# Altium schematic sheet BMS.SchDoc
size A; DocumentNumber: 3; SheetNumber: 3; SheetTotal: 7
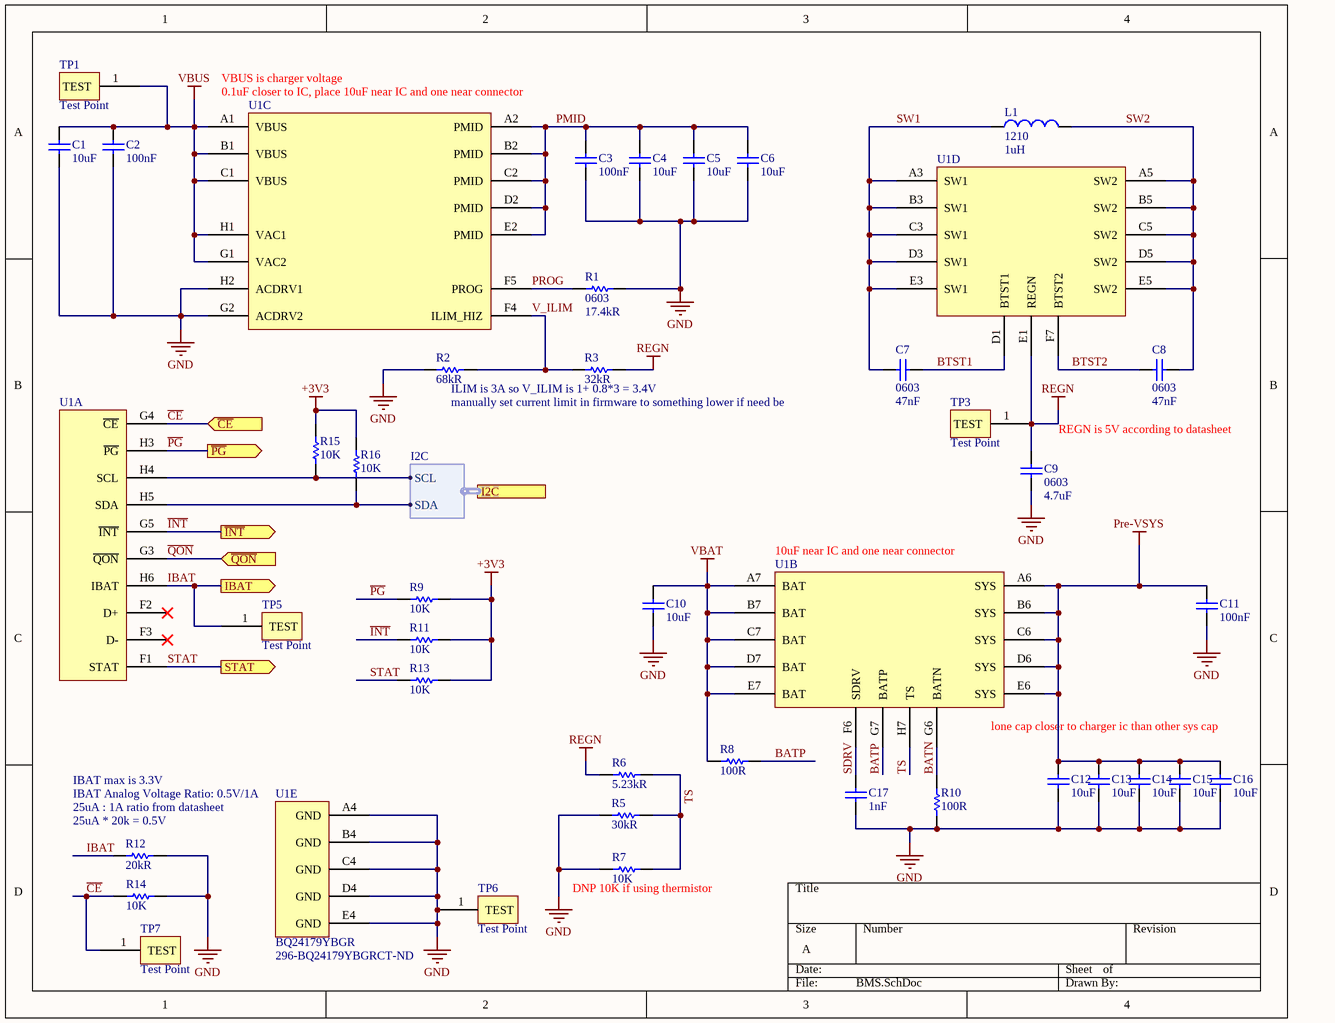
[diagram p0: BMS.SchDoc]

## Parts
C1  Capacitance: 10uF  [C0603]  (hidden comment: Capacitor 0603)
C2  Capacitance: 100nF  [C0402]  (hidden comment: Capacitor 0402)
C3  Capacitance: 100nF  [C0402]  (hidden comment: Capacitor 0402)
C4  Capacitance: 10uF  [C0603]  (hidden comment: Capacitor 0603)
C5  Capacitance: 10uF  [C0603]  (hidden comment: Capacitor 0603)
C6  Capacitance: 10uF  [C0603]  (hidden comment: Capacitor 0603)
C7  Package / Case: 0603  Capacitance: 47nF  [C0603]  (hidden comment: Capacitor 0603)
C8  Package / Case: 0603  Capacitance: 47nF  [C0603]  (hidden comment: Capacitor 0603)
C9  Package / Case: 0603  Capacitance: 4.7uF  [C0603]  (hidden comment: Capacitor 0603)
C10  Capacitance: 10uF  [C0603]  (hidden comment: Capacitor 0603)
C11  Capacitance: 100nF  [C0402]  (hidden comment: Capacitor 0402)
C12  Capacitance: 10uF  [C0603]  (hidden comment: Capacitor 0603)
C13  Capacitance: 10uF  [C0603]  (hidden comment: Capacitor 0603)
C14  Capacitance: 10uF  [C0603]  (hidden comment: Capacitor 0603)
C15  Capacitance: 10uF  [C0603]  (hidden comment: Capacitor 0603)
C16  Capacitance: 10uF  [C0603]  (hidden comment: Capacitor 0603)
C17  Capacitance: 1nF  [C0603]  (hidden comment: 478-1215-1-ND)
L1  Package / Case: 1210  Inductance: 1uH  [ind1210]  (hidden comment: Inductor 1210)
R1  Package / Case: 0603  Resistance: 17.4kR  [RES0603]  (hidden comment: Resistor 0603)
R2  Resistance: 68kR  [RES0402]  (hidden comment: Resistor 0402)
R3  Resistance: 32kR  [RES0402]  (hidden comment: Resistor 0402)
R5  Resistance: 30kR  [RES0402]  (hidden comment: Resistor 0402)
R6  Resistance: 5.23kR  [RES0402]  (hidden comment: Resistor 0402)
R7  Resistance (Ohms): 10K  [RES0603]  (hidden comment: ERJ-PB3B1002V)
R8  Resistance: 100R  [RES0603]  (hidden comment: Resistor 0603)
R9  Resistance (Ohms): 10K  [RES0603]  (hidden comment: ERJ-PB3B1002V)
R10  Resistance: 100R  [RES0603]  (hidden comment: Resistor 0603)
R11  Resistance (Ohms): 10K  [RES0603]  (hidden comment: ERJ-PB3B1002V)
R12  Resistance: 20kR  [RES0603]  (hidden comment: Resistor 0603)
R13  Resistance (Ohms): 10K  [RES0603]  (hidden comment: ERJ-PB3B1002V)
R14  Resistance (Ohms): 10K  [RES0603]  (hidden comment: ERJ-PB3B1002V)
R15  Resistance (Ohms): 10K  [RES0603]  (hidden comment: ERJ-PB3B1002V)
R16  Resistance (Ohms): 10K  [RES0603]  (hidden comment: ERJ-PB3B1002V)
TP1  Test Point  [TEST POINT]
TP3  Test Point  [TEST POINT]
TP5  Test Point  [TEST POINT]
TP6  Test Point  [TEST POINT]
TP7  Test Point  [TEST POINT]
U1  BQ24179YBGR  [BGA_79YBGR_TEX]  (value not drawn)  (parts A,B,C,D,E of 5)

## Ports
I2C (harness I2C), IBAT (out), STAT (out), ~{CE} (in), ~{INT} (out), ~{PG} (out), ~{QON} (in)

## Harnesses
I2C: SDA, SCL

## Nets
+3V3: R9.1 R11.1 R13.1 R15.1 R16.1
GND: C1.1 C2.1 C3.1 C4.1 C5.1 C6.1 C9.1 C10.1 C11.1 C12.1 C13.1 C14.1 C15.1 C16.1 C17.1 R1.1 R2.1 R5.1 R7.2 R10.1 R12.2 R14.1 TP6.1(TEST) U1.A4(GND) U1.B4(GND) U1.C4(GND) U1.D4(GND) U1.E4(GND) U1.G2(ACDRV2) U1.H2(ACDRV1)
Pre-VSYS: C11.2 C12.2 C13.2 C14.2 C15.2 C16.2 U1.A6(SYS) U1.B6(SYS) U1.C6(SYS) U1.D6(SYS) U1.E6(SYS)
REGN: C9.2 R3.2 R6.2 TP3.1(TEST) U1.E1(REGN)
VBAT: C10.2 R8.2 U1.A7(BAT) U1.B7(BAT) U1.C7(BAT) U1.D7(BAT) U1.E7(BAT)
VBUS: C1.2 C2.2 TP1.1(TEST) U1.A1(VBUS) U1.B1(VBUS) U1.C1(VBUS) U1.G1(VAC2) U1.H1(VAC1)
~{CE}: R14.2 TP7.1(TEST) U1.G4(~{CE}) ; port ~{CE}
~{INT}: R11.2 U1.G5(~{INT}) ; port ~{INT}
~{PG}: R9.2 U1.H3(~{PG}) ; port ~{PG}
~{QON}: U1.G3(~{QON}) ; port ~{QON}
BATN: R10.2 U1.G6(BATN)
BATP: R8.1 U1.G7(BATP)
BTST1: C7.2 U1.D1(BTST1)
BTST2: C8.1 U1.F7(BTST2)
IBAT: R12.1 TP5.1(TEST) U1.H6(IBAT) ; port IBAT
PMID: C3.2 C4.2 C5.2 C6.2 U1.A2(PMID) U1.B2(PMID) U1.C2(PMID) U1.D2(PMID) U1.E2(PMID)
PROG: R1.2 U1.F5(PROG)
SDRV: C17.2 U1.F6(SDRV)
STAT: R13.2 U1.F1(STAT) ; port STAT
SW1: C7.1 L1.1 U1.A3(SW1) U1.B3(SW1) U1.C3(SW1) U1.D3(SW1) U1.E3(SW1)
SW2: C8.2 L1.2 U1.A5(SW2) U1.B5(SW2) U1.C5(SW2) U1.D5(SW2) U1.E5(SW2)
TS: R5.2 R6.1 R7.1 U1.H7(TS)
V_ILIM: R2.2 R3.1 U1.F4(ILIM_HIZ)
NetR15_2: R15.2 U1.H4(SCL) ; port I2C.SCL
NetR16_2: R16.2 U1.H5(SDA) ; port I2C.SDA

Not connected (* = marked no-connect by the designer): U1 F2(D+)* F3(D-)*

## Notes on the sheet
- (near U1) VBUS is charger voltage
- (near U1) 0.1uF closer to IC, place 10uF near IC and one near connector
- ILIM is 3A so V_ILIM is 1+ 0.8*3 = 3.4V
- manually set current limit in firmware to something lower if need be
- REGN is 5V according to datasheet
- (near U1) 10uF near IC and one near connector
- (near U1) lone cap closer to charger ic than other sys cap
- IBAT Analog Voltage Ratio: 0.5V/1A
- (near R12) 25uA : 1A ratio from datasheet
- (near R12) 25uA * 20k = 0.5V
- IBAT max is 3.3V
- (near R7) DNP 10K if using thermistor

## Library data of the parts
C1 C4-C6 C10 C12-C16 = Capacitor 0603: Multilayer Ceramic Capacitors (High dielectric type), 25V, 10 uF, ± 20 %, 0603, X5R, RoHS; Manufacturer: Taiyo Yuden; Manufacturer Part Number: TMK107BBJ106MA-T; Tolerance: 20%; Package / Case: 0603; Supplier 1: Digi-Key; Supplier Part Number 1: 587-6023-1-ND; RoHS: Yes; Category: Ceramic Capacitors; Stock 1: 152813; Pricing 1: 1=0.46000, 10=0.32000, 50=0.22380, 100=0.19180, 500=0.14386, 1000=0.12149 (USD); Mount: Surface Mount; Case/Package: 0603; Case Code (Imperial): 0603; Case Code (Metric): 1608; Min Operating Temperature: -55°C; Max Operating Temperature: 85°C; Packaging: Tape and Reel; Voltage Rating: 25V; Lead Free: Lead Free; RoHS Compliant: Yes; ComponentLink1URL: http://ds.yuden.co.jp/TYCOMPAS/ut/detail.do?productNo=TMK107BBJ106MA-T&fileName=TMK107BBJ106MA-T_SS&mode=specSheetDownload&src-supplier=Digi-Key; ComponentLink1Description: http://ds.yuden.co.jp/TYCOMPAS/ut/detail.do?productNo=TMK107BBJ106MA-T&fileName=TMK107BBJ106MA-T_SS&mode=specSheetDownload&src-supplier=Digi-Key
C2 C3 C11 = Capacitor 0402: CAP CER 0.1UF 25V X5R 0402 / High Value Multilayer Ceramic Capacitors (High dielectric type); Manufacturer: Taiyo Yuden; Manufacturer Part Number: TMK105BJ104KV-F; Tolerance: 10%; Package / Case: 0402; Supplier 1: Digi-Key; Supplier Part Number 1: 587-1456-1-ND; RoHS: Yes; Category: Ceramic Capacitors; Stock 1: 2308231; Pricing 1: 1=0.10000, 10=0.04200, 50=0.02280, 100=0.01860, 500=0.01328, 1000=0.01044, 2500=0.00949, 5000=0.00873 (USD); Mount: Surface Mount; Case/Package: 0402; Number of Pins: 2; Case Code (Imperial): 0402; Case Code (Metric): 1005; Weight: 2.3E-05oz; Min Operating Temperature: -55°C; Max Operating Temperature: 85°C; Packaging: Tape and Reel; Dielectric: X5R; Voltage Rating (DC): 25V; Voltage Rating: 25V; Package Quantity: 1; Termination: SMD/SMT; Resistor Type: Ceramic; Voltage: 25V; Series: M; Construction: Flat; Length: 1mm; Width: 0.5mm; Height: 0.5mm; Depth: 0.5mm; Thickness: 0.022inch; REACH SVHC: No SVHC; Lead Free: Lead Free; Halogen Free: Halogen Free; RoHS Compliant: Yes; ComponentLink1URL: https://datasheet.ciiva.com/131/tmk105bj104kv-f-ss-131420.pdf?src-supplier=Digi-Key; ComponentLink1Description: https://datasheet.ciiva.com/131/tmk105bj104kv-f-ss-131420.pdf?src-supplier=Digi-Key; ComponentLink2URL: https://datasheet.ciiva.com/15922/28tmk105bj104kv-f-15922315.pdf?src-supplier=Onlinecomponents.com; ComponentLink2Description: https://datasheet.ciiva.com/15922/28tmk105bj104kv-f-15922315.pdf?src-supplier=Onlinecomponents.com; ComponentLink3URL: https://datasheet.ciiva.com/30051/25tmk105bj104kv-f-30051094.pdf?src-supplier=Onlinecomponents.com; ComponentLink3Description: https://datasheet.ciiva.com/30051/25tmk105bj104kv-f-30051094.pdf?src-supplier=Onlinecomponents.com; ComponentLink4URL: https://datasheet.ciiva.com/22768/1693457-22768649.pdf?src-supplier=Farnell; ComponentLink4Description: https://datasheet.ciiva.com/22768/1693457-22768649.pdf?src-supplier=Farnell
C7 C8 = Capacitor 0603: Cap Ceramic 0.047uF 50V X7R 10% SMD 0603 125°C Paper T/R; Manufacturer: KEMET; Manufacturer Part Number: C0603C473K5RAC7411; Supplier 1: Digi-Key; Supplier Part Number 1: 399-C0603C473K5RAC7411CT-ND; RoHS: Yes; Category: Ceramic Capacitors; Stock 1: 53312; Pricing 1: 1=0.10000, 10=0.07100, 50=0.03860, 100=0.03160, 500=0.02254, 1000=0.01771, 2500=0.01610, 5000=0.01481 (USD); Mount: Surface Mount; Case/Package: 0603; Dielectric Material: Ceramic; Min Operating Temperature: -55°C; Max Operating Temperature: 125°C; Tolerance: 10%; Dielectric: X7R; Voltage Rating (DC): 50V; Construction: Flat; Length: 1.6mm; Height: 0.8mm; Depth: 0.8mm; Radiation Hardening: No; RoHS Compliant: Yes; ComponentLink1URL: http://capacitoredge.kemet.com/capedge2/DataSheet?pn=C0603C473K5RAC7411&src-supplier=Avnet; ComponentLink1Description: http://capacitoredge.kemet.com/capedge2/DataSheet?pn=C0603C473K5RAC7411&src-supplier=Avnet; ComponentLink2URL: http://capacitoredge.kemet.com/capedge2/DataSheet?pn=C0603C473K5RAC7411&src-supplier=Avnet+Europe; ComponentLink2Description: http://capacitoredge.kemet.com/capedge2/DataSheet?pn=C0603C473K5RAC7411&src-supplier=Avnet+Europe
C9 = Capacitor 0603: CAP CER 4.7UF 25V X5R 0603; Manufacturer: TDK; Manufacturer Part Number: C1608X5R1E475M080AC; Dielectric Material: Ceramic; Tolerance: 20%; Supplier 1: Digi-Key; Supplier Part Number 1: 445-9040-1-ND; RoHS: Yes; Category: Ceramic Capacitors; Stock 1: 163174; Pricing 1: 1=0.38000, 10=0.25800, 50=0.17200, 100=0.14620, 500=0.10322, 1000=0.09032 (USD); Mount: Surface Mount; Case/Package: 0603; Case Code (Metric): 1608; Case Code (Imperial): 0603; Weight: 7.1E-05oz; Min Operating Temperature: -55°C; Max Operating Temperature: 85°C; Voltage Rating (DC): 25V; Packaging: Tape and Reel; Voltage Rating: 25V; Termination: SMD/SMT; Series: C; Package Quantity: 1; Dielectric: X5R; Resistor Type: Ceramic; Length: 1.6mm; Width: 0.031inch; Height: 0.8mm; Thickness: 0.039inch; Depth: 0.8mm; Radiation Hardening: No; REACH SVHC: No SVHC; Lead Free: Lead Free; RoHS Compliant: Yes; ComponentLink1URL: https://datasheet.ciiva.com/15192/getdatasheetpartid-726745-15192019.pdf?src-supplier=Verical; ComponentLink1Description: https://datasheet.ciiva.com/15192/getdatasheetpartid-726745-15192019.pdf?src-supplier=Verical
C17 = 06035C102KAT2A: CAP CER 1000PF 50V X7R 0603; Tolerance: ±20%; Applications: General Purpose; Supplier 1: Digi-Key; Supplier Part Number 1: 478-1215-1-ND; Voltage - Rated: 50V; Package / Case: 0603
L1 = Inductor 1210: Inductor Power Shielded Wirewound 1uH 20% 1MHz Metal 4.1A 0.022Ohm DCR 1210 Automotive T/R; Manufacturer: Murata; Manufacturer Part Number: DFE322520FD-1R0M=P2; Supplier 1: Digi-Key; Supplier Part Number 1: 490-18403-1-ND; RoHS: Yes; Category: Fixed Inductors; Stock 1: 831; Pricing 1: 1=0.99000, 10=0.86600, 25=0.80440, 50=0.68060, 100=0.61880, 250=0.58164, 500=0.51976, 1000=0.42075 (USD)
R1 = Resistor 0603: Res Thick Film 0603 17.4K Ohm 1% 0.1W(1/10W) ±100ppm/°C Pad SMD Automotive T/R; Manufacturer: Stackpole Electronics; Manufacturer Part Number: RMCF0603FT17K4; Power Rating: 100mW; Supplier 1: Digi-Key; Supplier Part Number 1: RMCF0603FT17K4CT-ND; RoHS: Yes; Category: Chip SMD Resistors; Stock 1: 31336; Pricing 1: 1=0.10000, 10=0.01700, 100=0.00680, 1000=0.00305, 2500=0.00264 (USD); Mount: Surface Mount; Case/Package: 0603; Case Code (Metric): 1608; Case Code (Imperial): 0603; Contact Plating: Tin,Matte; Size Code: 0603; Min Operating Temperature: -55°C; Max Operating Temperature: 155°C; Tolerance: 1%; Packaging: Tape and Reel; Resistor Type: Thick Film; Number of Terminations: 2; Max Power Dissipation: 100mW; Temperature Coefficient: 100ppm/°C; Features: Automotive AEC-Q200; Series: RMCF; Length: 0.061inch; Width: 0.031inch; Height: 0.022inch; Radiation Hardening: No; Lead Free: Lead Free; RoHS Compliant: Yes; ComponentLink1URL: https://www.seielect.com/catalog/SEI-RMCF_RMCP.pdf?src-supplier=Avnet; ComponentLink1Description: https://www.seielect.com/catalog/SEI-RMCF_RMCP.pdf?src-supplier=Avnet; ComponentLink2URL: https://www.seielect.com/catalog/SEI-Packaging.pdf?src-supplier=Digi-Key; ComponentLink2Description: https://www.seielect.com/catalog/SEI-Packaging.pdf?src-supplier=Digi-Key; ComponentLink3URL: http://www.seielect.com/Catalog/SEI-RMC.pdf?src-supplier=Future+Electronics; ComponentLink3Description: http://www.seielect.com/Catalog/SEI-RMC.pdf?src-supplier=Future+Electronics
R2 = Resistor 0402: Res Thin Film 0402 68K Ohm 0.1% 0.063W ±25ppm/°C Molded SMD Punched Carrier T/R; Manufacturer: Panasonic; Manufacturer Part Number: ERA-2AEB683X; Voltage Rating: 25V; Power Rating: 63mW; Package / Case: 0402; Supplier 1: Digi-Key; Supplier Part Number 1: P68KDCCT-ND; RoHS: Yes; Category: Chip SMD Resistors; Stock 1: 50182; Pricing 1: 1=0.41000, 10=0.29200, 100=0.11660, 1000=0.05748, 2500=0.05325, 5000=0.04818 (USD); Mount: Surface Mount; Case/Package: 0402; Number of Pins: 2; Contact Plating: Tin; Case Code (Metric): 1005; Case Code (Imperial): 0402; Min Operating Temperature: -55°C; Max Operating Temperature: 155°C; Tolerance: 0.1%; Resistor Type: Thin Film; Temperature Coefficient: 25ppm/°C; Packaging: Tape and Reel; Package Quantity: 10000; Number of Terminations: 2; Termination: SMD/SMT; Max Power Dissipation: 63mW; Voltage Rating (DC): 25V; Series: ERA-2A; Resistance Tolerance: 0.1%; Construction: Rectangular; Technology: METAL FILM; Length: 1mm; Width: 0.02inch; Height: 0.35mm; Depth: 0.5mm; Radiation Hardening: No; REACH SVHC: Unknown; Military Standard: Not; Lead Free: Lead Free; RoHS Compliant: Yes; ComponentLink1URL: https://datasheet.ciiva.com/11811/0900766b80beefcc-11811797.pdf?src-supplier=RSComponents; ComponentLink1Description: https://datasheet.ciiva.com/11811/0900766b80beefcc-11811797.pdf?src-supplier=RSComponents; ComponentLink2URL: https://datasheet.ciiva.com/6000/328837-6000892.pdf?src-supplier=Farnell; ComponentLink2Description: https://datasheet.ciiva.com/6000/328837-6000892.pdf?src-supplier=Farnell; ComponentLink3URL: https://datasheet.ciiva.com/7886/328837-7886575.pdf?src-supplier=Element14; ComponentLink3Description: https://datasheet.ciiva.com/7886/328837-7886575.pdf?src-supplier=Element14; ComponentLink4URL: https://datasheet.ciiva.com/6000/328837-6000893.pdf?src-supplier=Farnell; ComponentLink4Description: https://datasheet.ciiva.com/6000/328837-6000893.pdf?src-supplier=Farnell; ComponentLink5URL: https://datasheet.ciiva.com/46422/328837-46422458.pdf?src-supplier=Element14; ComponentLink5Description: https://datasheet.ciiva.com/46422/328837-46422458.pdf?src-supplier=Element14; ComponentLink6URL: https://datasheet.ciiva.com/22739/1776116-22739286.pdf?src-supplier=Element14; ComponentLink6Description: https://datasheet.ciiva.com/22739/1776116-22739286.pdf?src-supplier=Element14; ComponentLink7URL: https://datasheet.ciiva.com/28692/1776116-28692809.pdf?src-supplier=Element14; ComponentLink7Description: https://datasheet.ciiva.com/28692/1776116-28692809.pdf?src-supplier=Element14; ComponentLink8URL: https://datasheet.ciiva.com/24071/aoa0000ce26-197354-24071367.pdf?src-supplier=Mouser; ComponentLink8Description: https://datasheet.ciiva.com/24071/aoa0000ce26-197354-24071367.pdf?src-supplier=Mouser; ComponentLink9URL: https://datasheet.ciiva.com/9188/aoa0000ce26-9188063.pdf?src-supplier=Avnet; ComponentLink9Description: https://datasheet.ciiva.com/9188/aoa0000ce26-9188063.pdf?src-supplier=Avnet; ComponentLink10URL: https://datasheet.ciiva.com/30189/54aoa0000ce26-30189992.pdf?src-supplier=Onlinecomponents.com; ComponentLink10Description: https://datasheet.ciiva.com/30189/54aoa0000ce26-30189992.pdf?src-supplier=Onlinecomponents.com
R3 = Resistor 0402: Res, 32K, 1%, 0.063W, 0402 Rohs Compliant: Yes; Manufacturer: KOA Speer; Manufacturer Part Number: RN73H1ETTP3202F50; Power Rating: 63mW; Voltage Rating: 50V; Temperature Coefficient: 50ppm/°C; Package / Case: 0402; Supplier 1: Digi-Key; Supplier Part Number 1: 2019-RN73H1ETTP3202F50CT-ND; RoHS: Yes; Category: Chip SMD Resistors; Stock 1: 33713; Pricing 1: 1=0.46000, 10=0.35500, 100=0.14920, 1000=0.08232, 2500=0.07718, 5000=0.06946 (USD); Case/Package: 0402; Case Code (Imperial): 0402; Case Code (Metric): 1005; Min Operating Temperature: -55°C; Max Operating Temperature: 155°C; Packaging: Tape and Reel; Tolerance: 1%; Termination: SMD/SMT; Resistor Type: Metal Film; Voltage Rating (DC): 50V; Series: RN73H; Length: 1mm; Width: 0.5mm; Height: 0.35mm; ComponentLink1URL: https://datasheet.ciiva.com/12784/rn73h-12784440.pdf?src-supplier=Mouser; ComponentLink1Description: https://datasheet.ciiva.com/12784/rn73h-12784440.pdf?src-supplier=Mouser
R5 = Resistor 0402: Res Thick Film 0402 30K Ohm 5% 0.063W(1/16W) ±100ppm/C Pad SMD Automotive T/R; Manufacturer: Stackpole Electronics; Manufacturer Part Number: RMCF0402JT30K0; Max Power Dissipation: 63mW; Temperature Coefficient: 100ppm/°C; Package / Case: 0402; Supplier 1: Digi-Key; Supplier Part Number 1: RMCF0402JT30K0CT-ND; RoHS: Yes; Category: Chip SMD Resistors; Stock 1: 49900; Pricing 1: 1=0.10000, 10=0.01200, 100=0.00470, 1000=0.00213, 2500=0.00185, 5000=0.00153 (USD); Mount: Surface Mount; Case/Package: 0402; Case Code (Metric): 1005; Case Code (Imperial): 0402; Contact Plating: Tin,Matte; Min Operating Temperature: -55°C; Max Operating Temperature: 155°C; Packaging: Tape and Reel; Tolerance: 5%; Resistor Type: Thick Film; Number of Terminations: 2; Features: Automotive AEC-Q200; Series: RMCF; Length: 0.039inch; Width: 0.02inch; Height: 0.016inch; Lead Free: Lead Free; RoHS Compliant: Yes; ComponentLink1URL: https://www.seielect.com/Catalog/SEI-RMCF_RMCP.pdf?src-supplier=Avnet; ComponentLink1Description: https://www.seielect.com/Catalog/SEI-RMCF_RMCP.pdf?src-supplier=Avnet; ComponentLink2URL: https://www.seielect.com/Catalog/SEI-RMCF_RMCP.pdf?src-supplier=Digi-Key; ComponentLink2Description: https://www.seielect.com/Catalog/SEI-RMCF_RMCP.pdf?src-supplier=Digi-Key; ComponentLink3URL: https://www.seielect.com/catalog/SEI-Packaging.pdf?src-supplier=Digi-Key; ComponentLink3Description: https://www.seielect.com/catalog/SEI-Packaging.pdf?src-supplier=Digi-Key
R6 = Resistor 0402: Res Thick Film 0402 5.23K Ohm 1% 0.063W ±100ppm/°C Molded SMD Paper T/R; Manufacturer: Stackpole Electronics; Manufacturer Part Number: RMCF0402FT5K23; Max Power Dissipation: 63mW; Package / Case: 0402; Supplier 1: Digi-Key; Supplier Part Number 1: RMCF0402FT5K23CT-ND; RoHS: Yes; Category: Chip SMD Resistors; Stock 1: 68865; Pricing 1: 1=0.10000, 10=0.01500, 100=0.00610, 1000=0.00274, 2500=0.00238, 5000=0.00197 (USD); Mount: Surface Mount; Case/Package: 0402; Case Code (Metric): 1005; Case Code (Imperial): 0402; Contact Plating: Tin,Matte; Min Operating Temperature: -55°C; Max Operating Temperature: 155°C; Tolerance: 1%; Packaging: Tape and Reel; Resistor Type: Thick Film; Number of Terminations: 2; Temperature Coefficient: 100ppm/°C; Features: Automotive AEC-Q200; Series: RMCF; Length: 0.039inch; Width: 0.02inch; Height: 0.016inch; Radiation Hardening: No; Lead Free: Lead Free; RoHS Compliant: Yes; ComponentLink1URL: https://www.seielect.com/catalog/SEI-RMCF_RMCP.pdf?src-supplier=Avnet; ComponentLink1Description: https://www.seielect.com/catalog/SEI-RMCF_RMCP.pdf?src-supplier=Avnet; ComponentLink2URL: https://www.seielect.com/Catalog/SEI-RMCF_RMCP.pdf?src-supplier=Digi-Key; ComponentLink2Description: https://www.seielect.com/Catalog/SEI-RMCF_RMCP.pdf?src-supplier=Digi-Key; ComponentLink3URL: https://www.seielect.com/catalog/SEI-Packaging.pdf?src-supplier=Digi-Key; ComponentLink3Description: https://www.seielect.com/catalog/SEI-Packaging.pdf?src-supplier=Digi-Key
R7 R9 R11 R13-R16 = ERJ-PB3B1002V: RES SMD 10K OHM 5% 1/4W 0603; Power (Watts): 0.1W, 1/10W; Tolerance: ±1%; Supplier 1: Digi-Key; Supplier Part Number 1: P20086CT-ND; Package / Case: 0603
R8 R10 = Resistor 0603: Res Thick Film 0603 100 Ohm 1% 0.1W(1/10W) ±100ppm/°C Pad SMD Automotive T/R; Manufacturer: Stackpole Electronics; Manufacturer Part Number: RMCF0603FT100R; Power Rating: 100mW; Package / Case: 0603; Supplier 1: Digi-Key; Supplier Part Number 1: RMCF0603FT100RCT-ND; RoHS: Yes; Category: Chip SMD Resistors; Stock 1: 828887; Pricing 1: 1=0.10000, 10=0.01700, 100=0.00680, 1000=0.00305, 2500=0.00264 (USD); Mount: Surface Mount; Case/Package: 0603; Case Code (Metric): 1608; Case Code (Imperial): 0603; Contact Plating: Tin,Matte; Size Code: 0603; Min Operating Temperature: -55°C; Max Operating Temperature: 155°C; Tolerance: 1%; Packaging: Tape and Reel; Resistor Type: Thick Film; Number of Terminations: 2; Max Power Dissipation: 100mW; Temperature Coefficient: 100ppm/°C; Features: Automotive AEC-Q200; Series: RMCF; Construction: Rectangular; Length: 1.55mm; Width: 0.031inch; Height: 0.022inch; Depth: 0.8mm; Radiation Hardening: No; Military Standard: Not; Lead Free: Lead Free; RoHS Compliant: Yes; ComponentLink1URL: https://datasheet.ciiva.com/15215/getdatasheetpartid-360413-15215981.pdf?src-supplier=Verical; ComponentLink1Description: https://datasheet.ciiva.com/15215/getdatasheetpartid-360413-15215981.pdf?src-supplier=Verical
R12 = Resistor 0603: Res Thick Film 0603 20K Ohm 1% 0.1W(1/10W) ±100ppm/C Pad SMD Automotive T/R; Manufacturer: Stackpole Electronics; Manufacturer Part Number: RMCF0603FT20K0; Power Rating: 100mW; Temperature Coefficient: 100ppm/°C; Package / Case: 0603; Supplier 1: Digi-Key; Supplier Part Number 1: RMCF0603FT20K0CT-ND; RoHS: Yes; Category: Chip SMD Resistors; Stock 1: 1257328; Pricing 1: 1=0.10000, 10=0.01700, 100=0.00680, 1000=0.00305, 2500=0.00264 (USD); Mount: Surface Mount; Case/Package: 0603; Case Code (Metric): 1608; Case Code (Imperial): 0603; Contact Plating: Tin,Matte; Size Code: 0603; Min Operating Temperature: -55°C; Max Operating Temperature: 155°C; Tolerance: 1%; Packaging: Tape and Reel; Resistor Type: Thick Film; Number of Terminations: 2; Max Power Dissipation: 100mW; Features: Automotive AEC-Q200; Series: RMCF; Construction: Rectangular; Length: 1.55mm; Width: 0.031inch; Height: 0.022inch; Depth: 0.8mm; Radiation Hardening: No; Military Standard: Not; Lead Free: Lead Free; RoHS Compliant: Yes; ComponentLink1URL: https://datasheet.ciiva.com/15193/getdatasheetpartid-359905-15193453.pdf?src-supplier=Verical; ComponentLink1Description: https://datasheet.ciiva.com/15193/getdatasheetpartid-359905-15193453.pdf?src-supplier=Verical
U1 = BQ24179YBGR: INTEGRATED, NVDC, 5-A 1-CELL TO; Manufacturer: Texas Instruments; Supplier 1: Digi-Key; Manufacturer Part Number: BQ24179YBGR; RoHS: Yes; Stock 1: 2424; Pricing 1: 1=6.36000, 10=5.74300, 25=5.47600, 100=4.75470, 250=4.54104, 500=4.41000 (USD); Supplier Part Number 1: 296-BQ24179YBGRCT-ND